# Altium schematic sheet EDU_High-Speed-Design_Flash.SchDoc: Flash
size 279 x 215 mm; Date: not used; ApprovedBy: not used; CheckedBy: not used; Author: not used; DrawnBy: not used; Organization: not used; Address4: not used; SheetNumber: 9; SheetTotal: 26; Time: not used; ImagePath: not used; Application_BuildNumber: not used
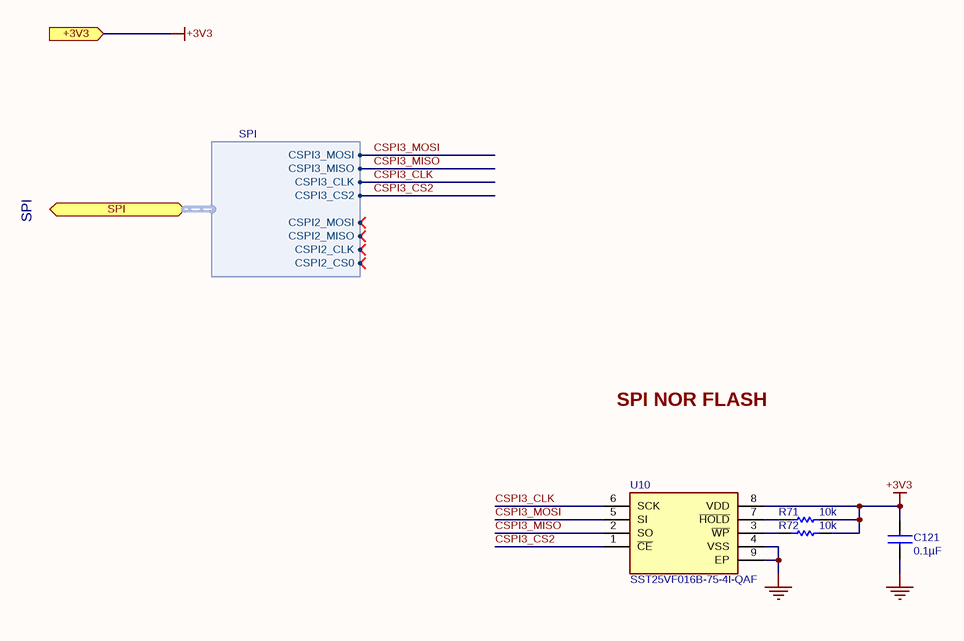
[diagram p0: EDU_High-Speed-Design_Flash.SchDoc]

## Parts
C121  0.1µF  [C0402]
R71  10k  [R0402]
R72  10k  [R0402]
U10  SST25VF016B-75-4I-QAF  [SST25VF016B]

## Ports
+3V3 (in), SPI (bidir, harness SPI)

## Harnesses
SPI: CSPI3_MOSI, CSPI3_MISO, CSPI3_CLK, CSPI3_CS2, CSPI2_MOSI, CSPI2_MISO, CSPI2_CLK, CSPI2_CS0

## Nets
+3V3: C121.1 R71.2 R72.2 U10.8(VDD) ; port +3V3
GND: C121.2 U10.4(VSS) U10.9(EP)
CSPI3_CLK: U10.6(SCK) ; port SPI.CSPI3_CLK
CSPI3_CS2: U10.1(~{CE}) ; port SPI.CSPI3_CS2
CSPI3_MISO: U10.2(SO) ; port SPI.CSPI3_MISO
CSPI3_MOSI: U10.5(SI) ; port SPI.CSPI3_MOSI
NetR71_1: R71.1 U10.7(~{HOLD})
NetR72_1: R72.1 U10.3(~{WP})

## Notes on the sheet
- SPI
- SPI NOR FLASH
- Title:
- Date:
- Size A
- Project:
- Time:
- Sheet
- Revision
- of
- Engineer:
- File:

## Library data of the parts
C121 = C1005X5R1H104K: CAP CER .10UF 50V X5R 10% 0402; Manufacturer 1: TDK Corporation; Capacitance: 0.1µF; Manufacturer Part Number 1: C1005X5R1H104K; Voltage: 50V; Supplier 1: Digi-Key; Supplier Part Number 1: 445-5942-1-ND; ComponentLink1URL: http://www.tdk.co.jp/tefe02/e412_c.pdf; ComponentLink1Description: http://www.tdk.co.jp/tefe02/e412_c.pdf
R71 R72 = RC0402FR-0710KL: RES 10.0K OHM 1/16W 1% 0402 SMD; Manufacturer 1: Yageo; Manufacturer Part Number 1: RC0402FR-0710KL; Resistance: 10k; Supplier 1: Digi-Key; Supplier Part Number 1: 311-10.0KLRCT-ND; ComponentLink1URL: http://www.yageo.com/documents/recent/PYu-RC0402_51_RoHS_L_6.pdf; ComponentLink1Description: http://www.yageo.com/documents/recent/PYu-RC0402_51_RoHS_L_6.pdf
U10 = SST25VF016B-75-4I-QAF: IC FLASH 16MBIT 75MHZ 8WSON; Manufacturer 1: Microchip Technology; Supplier 1: Digi-Key; Manufacturer Part Number 1: SST25VF016B-75-4I-QAF; ComponentLink1URL: http://ww1.microchip.com/downloads/en/DeviceDoc/25044A.pdf; ComponentLink1Description: http://ww1.microchip.com/downloads/en/DeviceDoc/25044A.pdf; Supplier Part Number 1: SST25VF016B-75-4I-QAF-ND